# EAGLE design SlaveMCU (EAGLE 9.6.2)
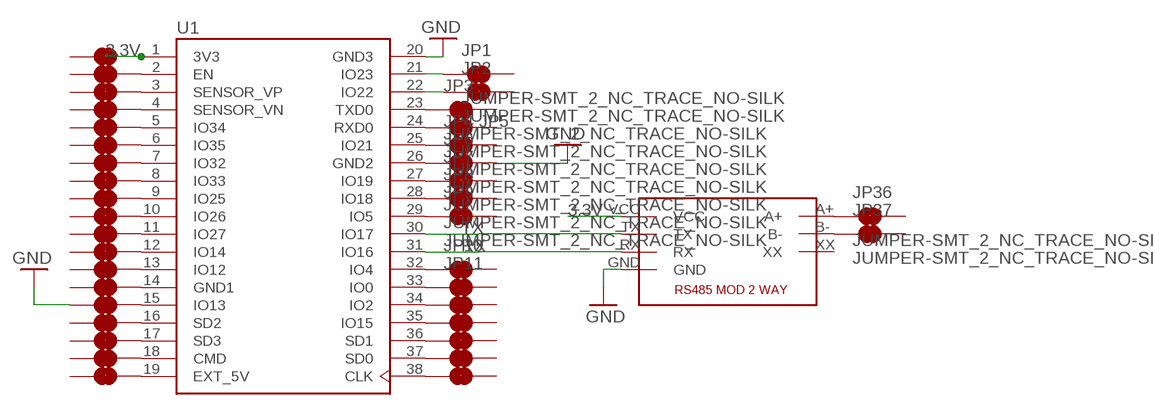
[diagram p0: schematic, sheet 1]

## Parts
JP1  JUMPER-SMT_2_NC_TRACE_NO-SILK  [SMT-JUMPER_2_NC_TRACE_NO-SILK]
JP2  JUMPER-SMT_2_NC_TRACE_NO-SILK  [SMT-JUMPER_2_NC_TRACE_NO-SILK]
JP3  JUMPER-SMT_2_NC_TRACE_NO-SILK  [SMT-JUMPER_2_NC_TRACE_NO-SILK]
JP4  JUMPER-SMT_2_NC_TRACE_NO-SILK  [SMT-JUMPER_2_NC_TRACE_NO-SILK]
JP5  JUMPER-SMT_2_NC_TRACE_NO-SILK  [SMT-JUMPER_2_NC_TRACE_NO-SILK]
JP6  JUMPER-SMT_2_NC_TRACE_NO-SILK  [SMT-JUMPER_2_NC_TRACE_NO-SILK]
JP7  JUMPER-SMT_2_NC_TRACE_NO-SILK  [SMT-JUMPER_2_NC_TRACE_NO-SILK]
JP8  JUMPER-SMT_2_NC_TRACE_NO-SILK  [SMT-JUMPER_2_NC_TRACE_NO-SILK]
JP9  JUMPER-SMT_2_NC_TRACE_NO-SILK  [SMT-JUMPER_2_NC_TRACE_NO-SILK]
JP10  JUMPER-SMT_2_NC_TRACE_NO-SILK  [SMT-JUMPER_2_NC_TRACE_NO-SILK]
JP11  JUMPER-SMT_2_NC_TRACE_NO-SILK  [SMT-JUMPER_2_NC_TRACE_NO-SILK]
JP12  JUMPER-SMT_2_NC_TRACE_NO-SILK  [SMT-JUMPER_2_NC_TRACE_NO-SILK]
JP13  JUMPER-SMT_2_NC_TRACE_NO-SILK  [SMT-JUMPER_2_NC_TRACE_NO-SILK]
JP14  JUMPER-SMT_2_NC_TRACE_NO-SILK  [SMT-JUMPER_2_NC_TRACE_NO-SILK]
JP15  JUMPER-SMT_2_NC_TRACE_NO-SILK  [SMT-JUMPER_2_NC_TRACE_NO-SILK]
JP16  JUMPER-SMT_2_NC_TRACE_NO-SILK  [SMT-JUMPER_2_NC_TRACE_NO-SILK]
JP17  JUMPER-SMT_2_NC_TRACE_NO-SILK  [SMT-JUMPER_2_NC_TRACE_NO-SILK]
JP18  JUMPER-SMT_2_NC_TRACE_NO-SILK  [SMT-JUMPER_2_NC_TRACE_NO-SILK]
JP19  JUMPER-SMT_2_NC_TRACE_NO-SILK  [SMT-JUMPER_2_NC_TRACE_NO-SILK]
JP20  JUMPER-SMT_2_NC_TRACE_NO-SILK  [SMT-JUMPER_2_NC_TRACE_NO-SILK]
JP21  JUMPER-SMT_2_NC_TRACE_NO-SILK  [SMT-JUMPER_2_NC_TRACE_NO-SILK]
JP22  JUMPER-SMT_2_NC_TRACE_NO-SILK  [SMT-JUMPER_2_NC_TRACE_NO-SILK]
JP23  JUMPER-SMT_2_NC_TRACE_NO-SILK  [SMT-JUMPER_2_NC_TRACE_NO-SILK]
JP24  JUMPER-SMT_2_NC_TRACE_NO-SILK  [SMT-JUMPER_2_NC_TRACE_NO-SILK]
JP25  JUMPER-SMT_2_NC_TRACE_NO-SILK  [SMT-JUMPER_2_NC_TRACE_NO-SILK]
JP26  JUMPER-SMT_2_NC_TRACE_NO-SILK  [SMT-JUMPER_2_NC_TRACE_NO-SILK]
JP27  JUMPER-SMT_2_NC_TRACE_NO-SILK  [SMT-JUMPER_2_NC_TRACE_NO-SILK]
JP28  JUMPER-SMT_2_NC_TRACE_NO-SILK  [SMT-JUMPER_2_NC_TRACE_NO-SILK]
JP29  JUMPER-SMT_2_NC_TRACE_NO-SILK  [SMT-JUMPER_2_NC_TRACE_NO-SILK]
JP30  JUMPER-SMT_2_NC_TRACE_NO-SILK  [SMT-JUMPER_2_NC_TRACE_NO-SILK]
JP31  JUMPER-SMT_2_NC_TRACE_NO-SILK  [SMT-JUMPER_2_NC_TRACE_NO-SILK]
JP32  JUMPER-SMT_2_NC_TRACE_NO-SILK  [SMT-JUMPER_2_NC_TRACE_NO-SILK]
JP33  JUMPER-SMT_2_NC_TRACE_NO-SILK  [SMT-JUMPER_2_NC_TRACE_NO-SILK]
JP34  JUMPER-SMT_2_NC_TRACE_NO-SILK  [SMT-JUMPER_2_NC_TRACE_NO-SILK]
JP35  JUMPER-SMT_2_NC_TRACE_NO-SILK  [SMT-JUMPER_2_NC_TRACE_NO-SILK]
JP36  JUMPER-SMT_2_NC_TRACE_NO-SILK  [SMT-JUMPER_2_NC_TRACE_NO-SILK]
JP37  JUMPER-SMT_2_NC_TRACE_NO-SILK  [SMT-JUMPER_2_NC_TRACE_NO-SILK]
U1  ESP32-DEVKITC-32D  [MODULE_ESP32-DEVKITC-32D]
U$2  RS485_MODULE  [RS485_MODULE]

## Nets
3.3V: JP35.2 U1.1(3V3) U$2.VCC
GND: JP6.2 JP21.1 U1.20(GND3) U$2.GND
N$1: JP1.1 U1.21(IO23)
N$3: JP4.1 U1.25(IO21)
N$4: JP5.1 U1.24(RXD0)
N$5: JP6.1 U1.26(GND2)
N$6: JP7.1 U1.27(IO19)
N$7: JP9.1 U1.29(IO5)
N$8: JP10.1 U1.32(IO4)
N$9: JP11.1 U1.33(IO0)
N$10: JP12.1 U1.34(IO2)
N$11: JP13.1 U1.35(IO15)
N$12: JP14.1 U1.36(SD1)
N$13: JP15.1 U1.37(SD0)
N$14: JP16.1 U1.38(CLK)
N$15: JP17.2 U1.19(EXT_5V)
N$16: JP18.2 U1.18(CMD)
N$17: JP19.2 U1.17(SD3)
N$18: JP20.2 U1.16(SD2)
N$19: JP21.2 U1.15(IO13)
N$20: JP22.2 U1.14(GND1)
N$21: JP23.2 U1.13(IO12)
N$22: JP24.2 U1.12(IO14)
N$23: JP26.2 U1.10(IO26)
N$24: JP27.2 U1.9(IO25)
N$25: JP28.2 U1.8(IO33)
N$26: JP29.2 U1.7(IO32)
N$27: JP30.2 U1.5(IO34)
N$28: JP31.2 U1.6(IO35)
N$29: JP32.2 U1.4(SENSOR_VN)
N$30: JP33.2 U1.3(SENSOR_VP)
N$31: JP34.2 U1.2(EN)
N$32: JP25.2 U1.11(IO27)
N$33: JP8.1 U1.28(IO18)
N$34: JP3.1 U1.23(TXD0)
N$35: JP2.1 U1.22(IO22)
N$36: JP36.1 U$2.A+
N$37: JP37.1 U$2.B-
RX: U1.31(IO16) U$2.RX
TX: U1.30(IO17) U$2.TX
Unconnected: JP1.2 JP2.2 JP3.2 JP4.2 JP5.2 JP7.2 JP8.2 JP9.2 JP10.2 JP11.2 JP12.2 JP13.2 JP14.2 JP15.2 JP16.2 JP17.1 JP18.1 JP19.1 JP20.1 JP22.1 JP23.1 JP24.1 JP25.1 JP26.1 JP27.1 JP28.1 JP29.1 JP30.1 JP31.1 JP32.1 JP33.1 JP34.1 JP35.1 JP36.2 JP37.2 U$2.XX

## Library data of the parts
JP1-JP37 = SparkFun-Jumpers:JUMPER-SMT_2_NC_TRACE: Normally closed trace jumper This jumper has a trace between two pads so it's normally closed (NC). Use a razor knife to open the connection. For best results follow the IPC guidelines for cutting traces: Cutout at least 0.063 mm (0.005 in). Remove all loose material to clean up the cut area. Seal the cut with an approved epoxy. Reapply solder to reclose the connection.
U1 = ESP32-DEVKITC-32D_antenna:ESP32-DEVKITC-32D: Eval Board For Esp-Wroom-32 Check availability <https://pricing.snapeda.com/parts/ESP32-DEVKITC-32D/Espressif%20Systems/view-part?ref=eda>; AVAILABILITY: In Stock; DESCRIPTION: WiFi Development Tools (802.11) ESP32 General Development Kit, ESP32-WROOM-32D on the board; MF: Espressif Systems; MP: ESP32-DEVKITC-32D; PACKAGE: None; PRICE: None; PURCHASE-URL: https://pricing.snapeda.com/search/part/ESP32-DEVKITC-32D/?ref=eda
U$2 = RS485_MODULE:RS485_MODULE

## Board
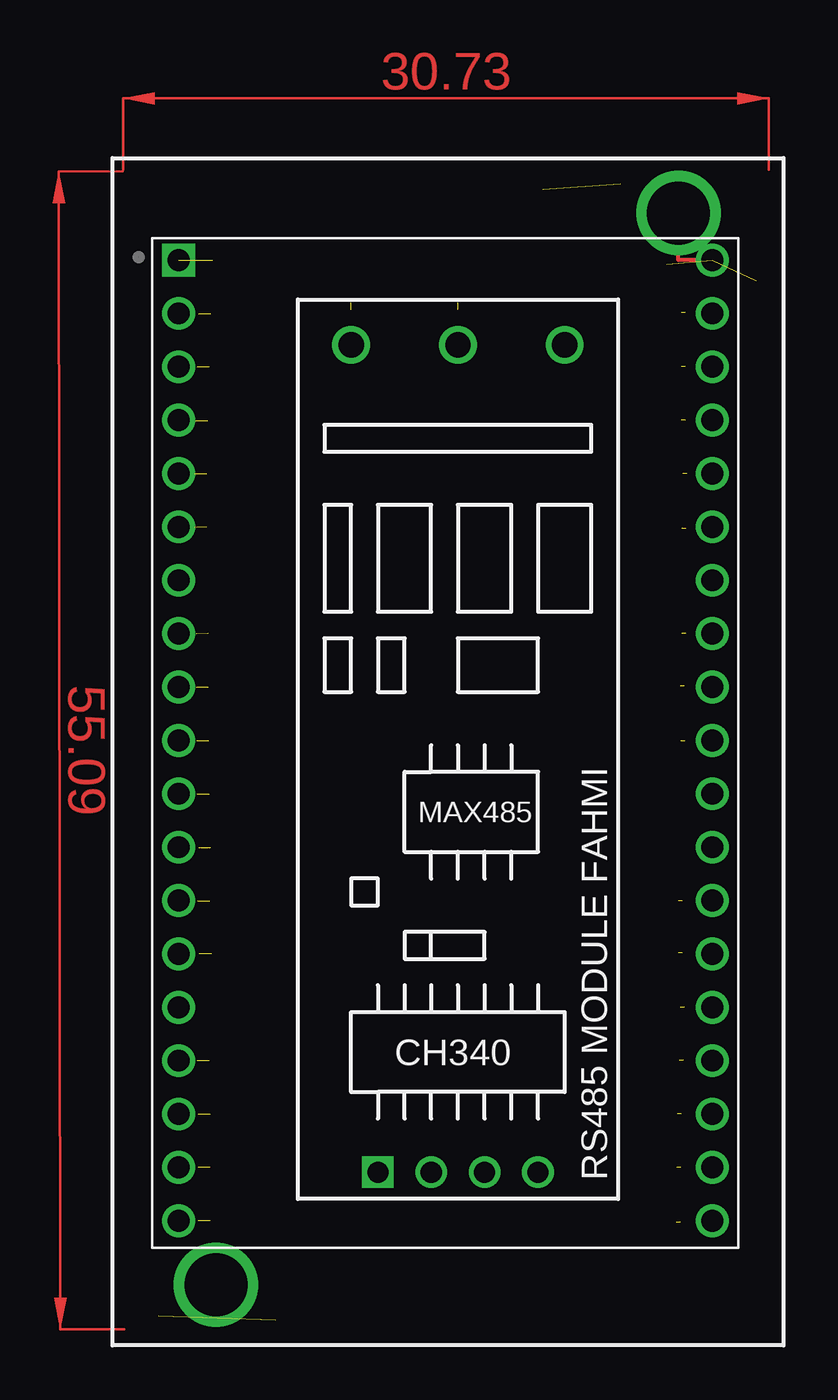
[diagram p1: board, top side]
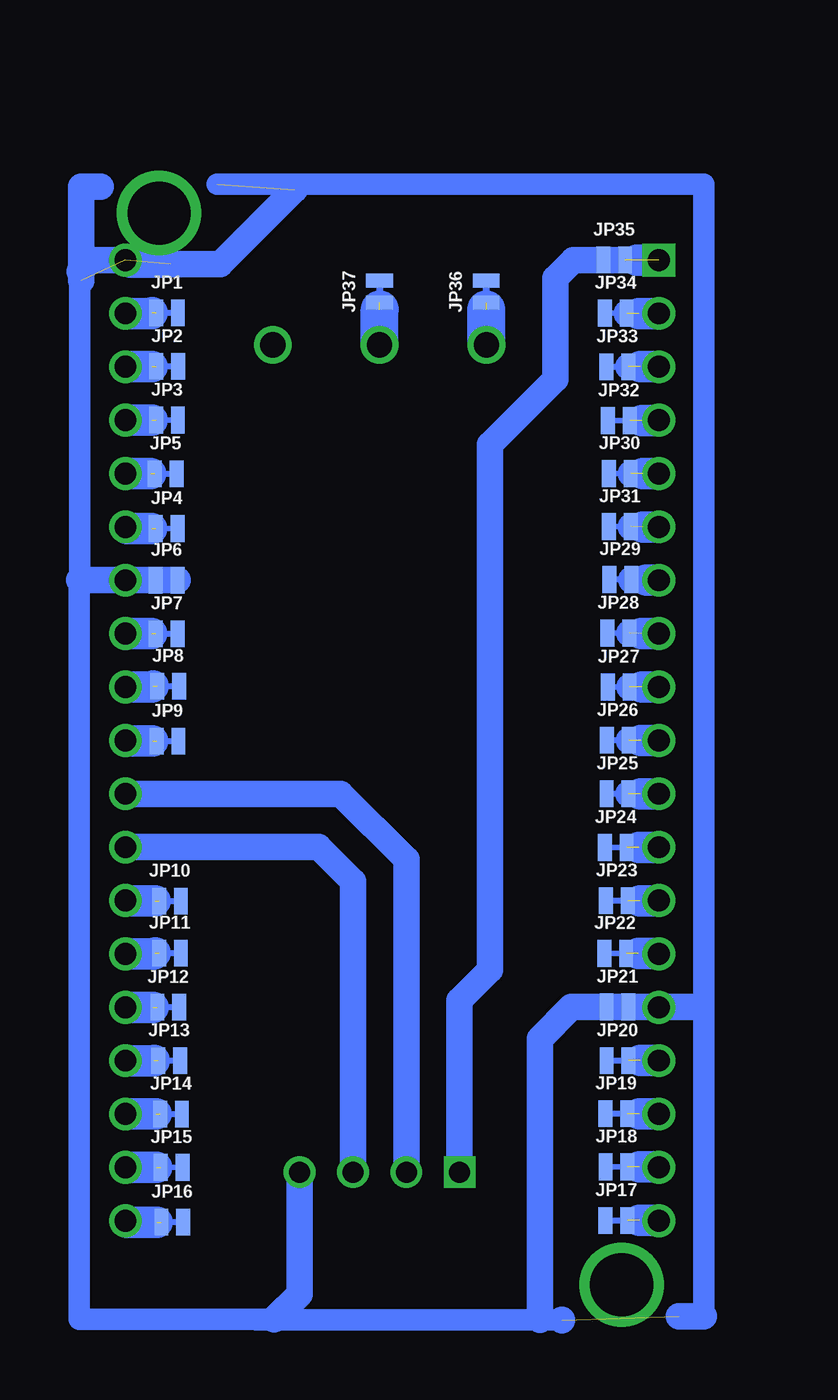
[diagram p2: board, bottom side, seen from below]

No outline drawn. Coordinates in mm, seen from the top.
Copper layers (1*16): Top 0.035mm / dielectric 1.5mm / Bottom 0.035mm
Design rules "default": minimum track width 6mil, minimum drill 0.35mm, track to track 6mil, track to pad 6mil, pad to pad 6mil, via to via 6mil, smd to smd 6mil, copper to edge 40mil, drill to drill 6mil, minimum pad ring 10mil, minimum via ring 8mil, stop-mask expansion 4mil, vias tented up to drill 0mil, thermal gap 10mil

### Footprints (pad centres in the part's own frame; a part is rotated, then mirrored left to right if it is on the bottom)
SMT-JUMPER_2_NC_TRACE_NO-SILK = smd 0.66 x 1.27: 1 -0.521,0; 2 0.521,0
MODULE_ESP32-DEVKITC-32D = drill 1.04 square: 1 -12.7,19.76 | drill 1.04: 2 -12.7,17.22; 3 -12.7,14.68; 4 -12.7,12.14; 5 -12.7,9.6; 6 -12.7,7.06; 7 -12.7,4.52; 8 -12.7,1.98; 9 -12.7,-0.56; 10 -12.7,-3.1; 11 -12.7,-5.64; 12 -12.7,-8.18; 13 -12.7,-10.72; 14 -12.7,-13.26; 15 -12.7,-15.8; 16 -12.7,-18.34; 17 -12.7,-20.88; 18 -12.7,-23.42; 19 -12.7,-25.96; 20 12.7,19.76; 21 12.7,17.22; 22 12.7,14.68; 23 12.7,12.14; 24 12.7,9.6; 25 12.7,7.06; 26 12.7,4.52; 27 12.7,1.98; 28 12.7,-0.56; 29 12.7,-3.1; 30 12.7,-5.64; 31 12.7,-8.18; 32 12.7,-10.72; 33 12.7,-13.26; 34 12.7,-15.8; 35 12.7,-18.34; 36 12.7,-20.88; 37 12.7,-23.42; 38 12.7,-25.96
RS485_MODULE = drill 1.2: A+ 30.48,5.08; B- 30.48,0; XX 30.48,-5.08 | drill 1: GND -8.89,-3.81; RX -8.89,-1.27; TX -8.89,1.27 | drill 1 square: VCC -8.89,3.81

### Placement (x,y rotation side)
JP1  26.63,62.48 0 bottom
JP2  26.62,59.93 0 bottom
JP3  26.63,57.38 0 bottom
JP4  26.64,52.22 0 bottom
JP5  26.7,54.83 0 bottom
JP6  26.64,49.76 0 bottom
JP7  26.64,47.22 0 bottom
JP8  26.58,44.72 0 bottom
JP9  26.61,42.1 0 bottom
JP10  26.49,34.49 0 bottom
JP11  26.49,32.02 0 bottom
JP12  26.57,29.44 0 bottom
JP13  26.53,26.9 0 bottom
JP14  26.44,24.36 0 bottom
JP15  26.42,21.82 0 bottom
JP16  26.38,19.22 0 bottom
JP17  5.25,19.29 0 bottom
JP18  5.23,21.84 0 bottom
JP19  5.25,24.37 0 bottom
JP20  5.18,26.9 0 bottom
JP21  5.18,29.45 0 bottom
JP22  5.3,32 0 bottom
JP23  5.22,34.51 0 bottom
JP24  5.27,37.05 0 bottom
JP25  5.18,39.6 0 bottom
JP26  5.17,42.14 0 bottom
JP27  5.13,44.68 0 bottom
JP28  5.14,47.24 0 bottom
JP29  5.05,49.8 0 bottom
JP30  5.08,54.84 0 bottom
JP31  5.07,52.31 0 bottom
JP32  5.12,57.35 0 bottom
JP33  5.19,59.92 0 bottom
JP34  5.27,62.47 0 bottom
JP35  5.35,65 0 bottom
JP36  11.43,63.5 90 bottom
JP37  16.51,63.5 90 bottom
U1  15.91,45.24 0 top
U$2  16.51,30.48 90 top

### Tracks (layer width: path | path; a pad name or v marks a point on that pad's centre or on a via)
3.3V  (1 unrouted)
  Bottom 1.27: JP35.2 7.29,65 8.15,64.14 8.15,59.32 11.25,56.22 11.25,31.2 12.7,29.76 U$2.VCC
  Bottom 1.5: U1.1 4.25,65
GND  (via drill 3)  (4 unrouted)
  Top 0.2: U1.20 27.01,65 v27.01,67.23
  Bottom 1.016: 30.8,64.45 30.8,49.76 | 30.81,49.76 30.81,14.58 21.53,14.58 | 1.08,14.73 1.08,68.61 24.24,68.61 | 22.39,14.55 8.89,14.55 7.84,14.55
  Bottom 1.27: U1.20 28.39,64.77 26.67,64.77 26.9,65 U1.20 | U1.20 30.25,65 30.8,64.45 | U$2.GND 20.32,15.79 21.53,14.58 | 2.27,14.73 1.08,14.73 | 7.84,14.55 7.82,14.54 | 26.47,64.81 24.09,64.81 20.55,68.35 | 30.72,64.02 30.72,68.49 29.79,68.49 | 1.31,29.46 3.24,29.46 3.25,29.45 JP21.1 7.38,29.45 8.89,27.94 8.89,14.55 | JP6.2 30.81,49.76
N$1  (1 unrouted)
  Bottom 1.5: U1.21 27.37,62.46 27.34,62.48
N$2  (via drill 3)
  other vias: 4.99,16.23
N$3  (1 unrouted)
  Bottom 1.5: U1.25 28.54,52.22 27.36,52.22
N$4  (1 unrouted)
  Bottom 1.5: U1.24 28.6,54.83 27.41,54.83
N$5
  Bottom 1.27: JP6.1 U1.26
N$6  (1 unrouted)
  Bottom 1.5: U1.27 27.36,47.22
N$7  (1 unrouted)
  Bottom 1.5: U1.29 28.58,42.1 27.32,42.1
N$8  (1 unrouted)
  Bottom 1.5: U1.32 28.59,34.49 27.2,34.49
N$9  (1 unrouted)
  Bottom 1.5: U1.33 27.24,31.98 27.2,32.02
N$10  (1 unrouted)
  Bottom 1.5: U1.34 27.28,29.44
N$11  (1 unrouted)
  Bottom 1.5: U1.35 27.24,26.9
N$12  (1 unrouted)
  Bottom 1.5: U1.36 27.15,24.36
N$13  (1 unrouted)
  Bottom 1.5: U1.37 27.13,21.82
N$14  (1 unrouted)
  Bottom 1.5: U1.38 28.55,19.21 27.09,19.21
N$15  (1 unrouted)
  Bottom 1.5: U1.19 3.23,19.29 4.15,19.29
N$16  (1 unrouted)
  Bottom 1.5: U1.18 3.24,21.84 4.14,21.84
N$17  (1 unrouted)
  Bottom 1.5: U1.17 3.23,24.37 4.15,24.37
N$18  (1 unrouted)
  Bottom 1.5: U1.16 4.09,26.9
N$19
  Bottom 1.27: JP21.2 3.21,29.45 U1.15
N$20  (1 unrouted)
  Bottom 1.5: U1.14 3.24,32 4.2,32
N$21  (1 unrouted)
  Bottom 1.5: U1.13 3.23,34.51 4.13,34.51
N$22  (1 unrouted)
  Bottom 1.5: U1.12 3.23,37.05 4.18,37.05
N$23  (1 unrouted)
  Bottom 1.27: JP26.2
  Bottom 1.5: U1.10 4.08,42.14
N$24  (1 unrouted)
  Bottom 1.27: JP27.2
  Bottom 1.5: U1.9 4.04,44.68
N$25  (1 unrouted)
  Bottom 1.27: JP28.2 4.62,47.22
  Bottom 1.5: U1.8 4.05,47.22
N$26
  Bottom 1.27: JP29.2 4.53,49.76 3.81,49.76
  Bottom 1.5: U1.7 3.81,49.76
N$27  (1 unrouted)
  Bottom 1.27: JP30.2
  Bottom 1.5: U1.5 3.99,54.84
N$28  (1 unrouted)
  Bottom 1.27: JP31.2 4.55,52.3
  Bottom 1.5: U1.6 3.97,52.3
N$29  (1 unrouted)
  Bottom 1.5: U1.4 3.24,57.35 4.03,57.35
N$30  (1 unrouted)
  Bottom 1.27: JP33.2
  Bottom 1.5: U1.3 4.1,59.92
N$31  (1 unrouted)
  Bottom 1.27: JP34.2 4.74,62.46 | U1.2 3.99,62.46 3.99,62.45 3.21,62.45 U1.2
  Bottom 1.5: U1.2 4.18,62.46
N$32  (1 unrouted)
  Bottom 1.27: JP25.2
  Bottom 1.5: U1.11 4.09,39.6
N$33  (1 unrouted)
  Bottom 1.5: U1.28 27.33,44.68 27.29,44.72
N$34  (1 unrouted)
  Bottom 1.5: U1.23 27.34,57.38
N$35  (1 unrouted)
  Bottom 1.5: U1.22 27.34,59.92 27.33,59.93
N$36  (1 unrouted)
  Bottom 1.8: U$2.A+ 11.43,62.64
N$37  (1 unrouted)
  Bottom 1.8: U$2.B- 16.51,62.64
RX
  Bottom 1.27: U1.31 19.42,37.06 17.78,35.42 U$2.RX
TX
  Bottom 1.27: U1.30 18.36,39.6 15.24,36.47 U$2.TX
(copper drawn outside any net)
  shapes: Top area x2